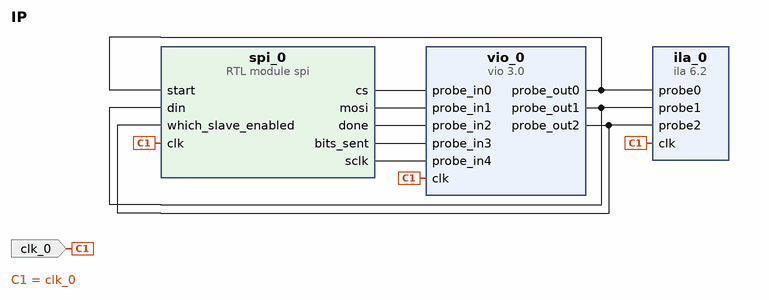
[diagram p0: block diagram of the top level]
# Vivado block design IP, xc7k325tffg900-2, Vivado 2018.2
create_bd_design IP

create_bd_port -dir I -type clk clk_0

create_bd_cell -type module -reference spi spi_0
create_bd_cell -type ip -vlnv xilinx.com:ip:vio:3.0 vio_0
set_property -dict [list \
  CONFIG.C_PROBE_OUT2_WIDTH 4 \
  CONFIG.C_PROBE_OUT1_WIDTH 12 \
  CONFIG.C_PROBE_IN3_WIDTH 12 \
  CONFIG.C_PROBE_IN0_WIDTH 4 \
  CONFIG.C_NUM_PROBE_OUT 3 \
  CONFIG.C_NUM_PROBE_IN 5 \
] [get_bd_cells vio_0]
create_bd_cell -type ip -vlnv xilinx.com:ip:ila:6.2 ila_0
set_property -dict [list \
  CONFIG.C_PROBE2_WIDTH 4 \
  CONFIG.C_PROBE1_WIDTH 12 \
  CONFIG.C_NUM_OF_PROBES 3 \
  CONFIG.C_ENABLE_ILA_AXI_MON false \
  CONFIG.C_MONITOR_TYPE Native \
] [get_bd_cells ila_0]

# ---- connections ----

connect_bd_net -net clk_0_1 [get_bd_ports clk_0] [get_bd_pins vio_0/clk] [get_bd_pins spi_0/clk] [get_bd_pins ila_0/clk]
connect_bd_net [get_bd_pins vio_0/probe_out0] [get_bd_pins spi_0/start] [get_bd_pins ila_0/probe0]
connect_bd_net [get_bd_pins vio_0/probe_out1] [get_bd_pins spi_0/din] [get_bd_pins ila_0/probe1]
connect_bd_net [get_bd_pins vio_0/probe_out2] [get_bd_pins spi_0/which_slave_enabled] [get_bd_pins ila_0/probe2]
connect_bd_net [get_bd_pins spi_0/cs] [get_bd_pins vio_0/probe_in0]
connect_bd_net [get_bd_pins spi_0/mosi] [get_bd_pins vio_0/probe_in1]
connect_bd_net [get_bd_pins spi_0/done] [get_bd_pins vio_0/probe_in2]
connect_bd_net [get_bd_pins spi_0/bits_sent] [get_bd_pins vio_0/probe_in3]
connect_bd_net [get_bd_pins spi_0/sclk] [get_bd_pins vio_0/probe_in4]

validate_bd_design
save_bd_design
